# Altium schematic sheet Power.SchDoc: Titel
size A4; ApprovedBy: name; CompanyName: DCI Electronics bv; DrawnBy: KRS; Address1: Nijverheidsstraat 14; Address2: 4458 AV Eindewege; Address3: Phone: +31 (0)113 344880; DocumentNumber: 3; Revision: 0; SheetNumber: 4; SheetTotal: 5; PageSetup: Record=PageOptions|CenterHorizontal=True|CenterVertical=True|PrintScale=1.00|XCorrection=1.00|YCorrection=1.00|PrintKind=1|BorderSize=5000000|LeftOffset=0|BottomOffset=0|Orientation=2|PaperLength=1000|PaperWidth=1000|Scale=100|PaperSource=7|PrintQuality=-4|MediaType=1|DitherType=10|PaperKind=ISO_A4_(210.00_x_297.00_MM)|PrintScaleMode=1; SubTitle: SubTitel; ApprovedDate: 01-01-12; DesignedBy: KRS
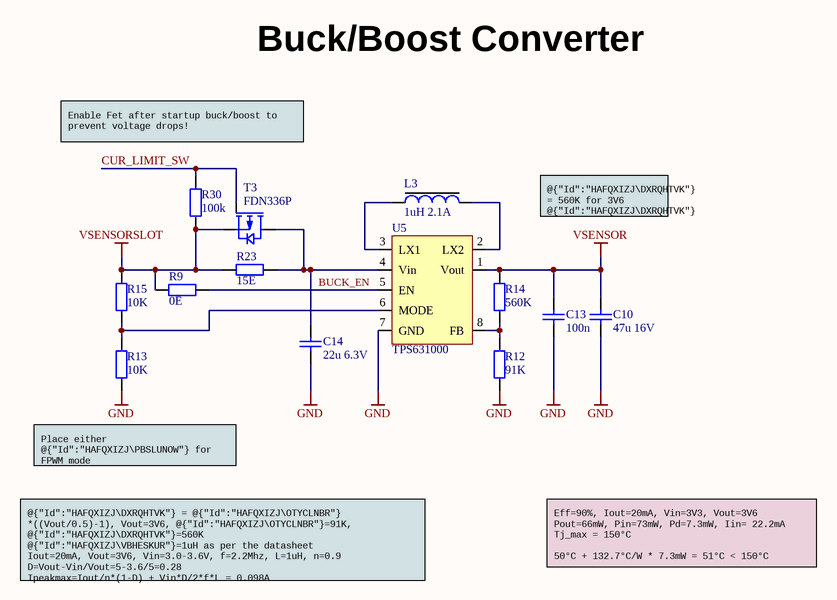
[diagram p0: Power.SchDoc]

## Parts
C10  47u 16V  [CAPC3225X27N]
C13  100n  [CAPC1608X09N]
C14  22u 6.3V  [CAPC1608X09N]
L3  1uH 2.1A  [IND-001G002-002]
R9  0E  [RESC1608X13N]
R12  91K  [RESC1608X13N]
R13  10K  [RESC1608X13N]
R14  560K  [RESC1608X13N]
R15  10K  [RESC1608X13N]
R23  15E  [RESC2013X14N]
R30  100k  [RESC1608X13N]
T3  FDN336P  [SOT95P245X110_GSD-3N]
U5  TPS631000  [SOT-501001-008]

## Nets
GND: C10.1 C13.1 C14.1 R12.1 R13.1 U5.7(GND)
VSENSOR: C10.2 C13.2 R14.2 U5.1(Vout)
VSENSORSLOT: R9.2 R15.2 R23.1 R30.1 T3.S
BUCK_EN: R9.1 U5.5(EN)
CUR_LIMIT_SW: R30.2 T3.G
NetC14_2: C14.2 R23.2 T3.D U5.4(Vin)
NetL3_1: L3.1 U5.3(LX1)
NetL3_2: L3.2 U5.2(LX2)
NetR12_2: R12.2 R14.1 U5.8(FB)
NetR13_2: R13.2 R15.1 U5.6(MODE)

## Notes on the sheet
- Buck/Boost Converter
- Enable Fet after startup buck/boost to prevent voltage drops!
- @{"Id":"HAFQXIZJ\DXRQHTVK"} = 560K for 3V6
  @{"Id":"HAFQXIZJ\DXRQHTVK"} = 806K for 5V
- (near R13) Place either @{"Id":"HAFQXIZJ\PBSLUNOW"} for FPWM mode
  or @{"Id":"HAFQXIZJ\QUYZTFQX"} for PFM mode
- Eff=90%, Iout=20mA, Vin=3V3, Vout=3V6
  Pout=66mW, Pin=73mW, Pd=7.3mW, Iin= 22.2mA
  Tj_max = 150°C
  50°C + 132.7°C/W * 7.3mW = 51°C < 150°C
- @{"Id":"HAFQXIZJ\DXRQHTVK"} = @{"Id":"HAFQXIZJ\OTYCLNBR"} *((Vout/0.5)-1), Vout=3V6, @{"Id":"HAFQXIZJ\OTYCLNBR"}=91K, @{"Id":"HAFQXIZJ\DXRQHTVK"}=560K
  @{"Id":"HAFQXIZJ\VBHESKUR"}=1uH as per the datasheet
  Iout=20mA, Vout=3V6, Vin=3.0-3.6V, f=2.2Mhz, L=1uH, n=0.9
  D=Vout-Vin/Vout=5-3.6/5=0.28
  Ipeakmax=Iout/n*(1-D) + Vin*D/2*f*L = 0.098A
  Isaturation = 0.098A+20%= 118mA
- Designed by:
- Drawing number:
- Variant:
- Date:
- Page:
- Rev:
- Of:
- Dekimo Goes B.V.
- Nijverheidsstraat 14, 4458 AV  Eindewege, Phone: +31 (0)113 344880

## Library data of the parts
C10 = CKE 47UV16/15: 47uF 16V 20% X5R; EngPartGrpMainCode: CAP; ManufactpartCode: EMK325BJ476MM-P-TAI; Type: Capacitor ceramic SMD; Preferred: False; SMD_Flag: True; PartCode: CKE 47UV16/15
C13 = CKE 100N/60: 100nF 50V 10% X7R; EngPartGrpMainCode: CAP; ManufactpartCode: CC0603KRX7R9BB104-YAG; Type: Capacitor ceramic SMD; Preferred: False; SMD_Flag: True; PartCode: CKE 100N/60
C14 = CKE 22UV6.3/60: 22uF 20%  6.3V X5R; EngPartGrpMainCode: CAP; ManufactpartCode: GRM188R60J226MEA0D-MUR; Type: Capacitor ceramic SMD; Preferred: False; SMD_Flag: True; PartCode: CKE 22UV6.3/60
L3 = IND 1U 2A1/1: Power inductor 2.1A; EngPartGrpMainCode: IND; ManufactpartCode: 74479276210C-WE; Type: Inductor choke SMD; Preferred: False; SMD_Flag: True; PartCode: IND 1U 2A1/1
R9 = R 0E/60: 0E 100mW, 1%; PartCode: R 0E/60; EngPartGrpMainCode: RES; ManufactpartCode: RC0603FR-070RL-YAG; Preferred: True; Type: Resistor metalfilm SMD; SMD_Flag: True
R12 = R 91K/60: 91k 0.06W 1%; EngPartGrpMainCode: RES; ManufactpartCode: RC0603FR-0791KL-YAG; Preferred: False; SMD_Flag: True; PartCode: R 91K/60; Type: Resistor metalfilm SMD
R13 R15 = R 10K/60: 10k 100mW, 1%; EngPartGrpMainCode: RES; ManufactpartCode: RC0603FR-0710KL-YAG; Preferred: True; PartCode: R 10K/60; Type: Resistor metalfilm SMD; SMD_Flag: True
R14 = R 560K/60: 560kΩ 100mW 1%; EngPartGrpMainCode: RES; ManufactpartCode: RC0603FR-07560KL-YAG; Preferred: False; SMD_Flag: True; PartCode: R 560K/60; Type: Resistor metalfilm SMD
R23 = R 15E/11: 15Ω 125mW 1%; EngPartGrpMainCode: RES; ManufactpartCode: RC0805FR-0715RL-YAG; Preferred: False; SMD_Flag: True; PartCode: R 15E/11; Type: Resistor metalfilm SMD
R30 = R 100K/60: 100kΩ 100mW 1%; EngPartGrpMainCode: RES; ManufactpartCode: CRG0603F100K-TEC; Preferred: True; PartCode: R 100K/60; Type: Resistor metalfilm SMD; SMD_Flag: True
T3 = TRA FDN336P: 20V 1.3A 200mΩ logic level; EngPartGrpMainCode: TRAN; ManufactpartCode: FDN336P-FCH; Type: FET P-channel SMD; Preferred: False; SMD_Flag: True; PartCode: TRA FDN336P
U5 = IC TPS631000: Buck/boost 1.5-5.5V, 1A5; EngPartGrpMainCode: IC; ManufactpartCode: TPS631000DRLR-TI; Preferred: False; SMD_Flag: True; PartCode: IC TPS631000; Type: IC regulator SMD